# Altium schematic sheet SampleANDHold.SchDoc
size A4
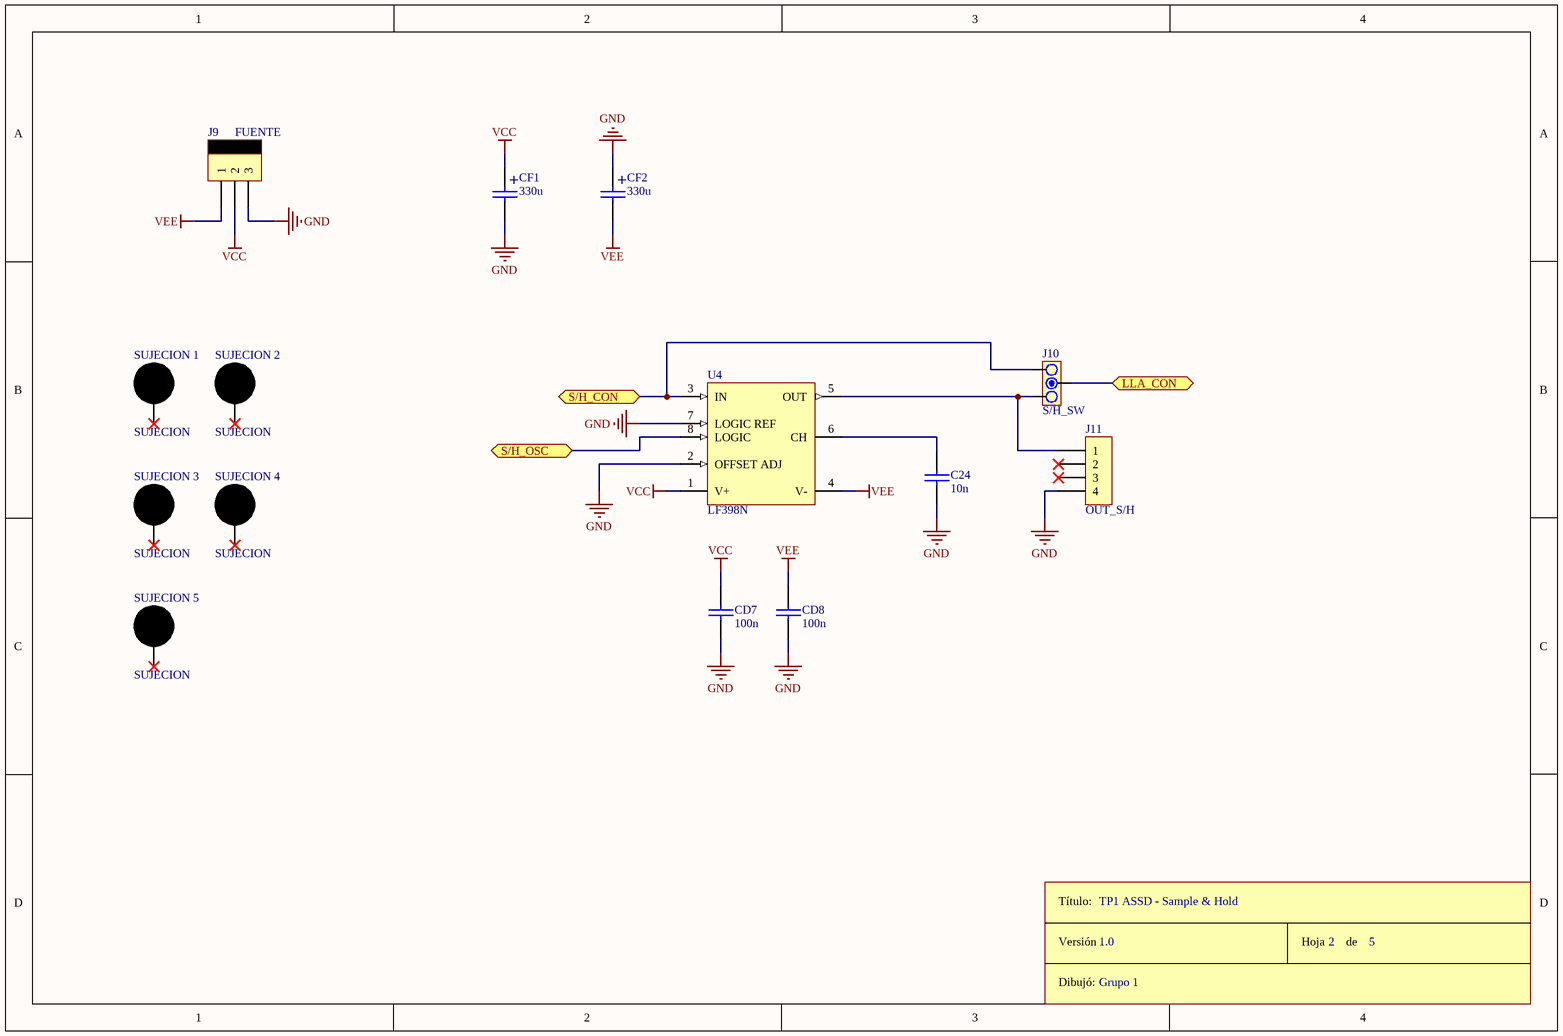
[diagram p0: SampleANDHold.SchDoc]

## Parts
C24  10n  [CAP100]
CD7  100n  [CAP100]
CD8  100n  [CAP100]
CF1  330u  [CAP200RP]
CF2  330u  [CAP200RP]
J9  FUENTE  [MOLEX3]
J10  S/H_SW  [JUMPER3]
J11  OUT_S/H  [SIP4]
ROT2  Rótulo  (value not drawn)
SUJECION_1  SUJECION  [SUJECION (5.00MM - 3.50MM)]
SUJECION_2  SUJECION  [SUJECION (5.00MM - 3.50MM)]
SUJECION_3  SUJECION  [SUJECION (5.00MM - 3.50MM)]
SUJECION_4  SUJECION  [SUJECION (5.00MM - 3.50MM)]
SUJECION_5  SUJECION  [SUJECION (5.00MM - 3.50MM)]
U4  LF398N  [N08E]

## Ports
LLA_CON, S/H_CON, S/H_OSC

## Nets
GND: C24.2 CD7.2 CD8.2 CF1.2 CF2.1 J9.3 J11.4 U4.2(OFFSET_ADJ) U4.7(LOGIC_REF)
VCC: CD7.1 CF1.1 J9.2 U4.1(V+)
VEE: CD8.1 CF2.2 J9.1 U4.4(V-)
LLA_CON: J10.2 ; port LLA_CON
S/H_CON: J10.3 U4.3(IN) ; port S/H_CON
S/H_OSC: U4.8(LOGIC) ; port S/H_OSC
NetC24_1: C24.1 U4.6(CH)
NetJ10_1: J10.1 J11.1 U4.5(OUT)

Not connected (* = marked no-connect by the designer): J11 2* 3*; SUJECION_1 1*; SUJECION_2 1*; SUJECION_3 1*; SUJECION_4 1*; SUJECION_5 1*

## Notes on the sheet
- TP1 ASSD - Sample & Hold
- 1.0
- Grupo 1
- 2
- 5
- (in symbol CAPPOL) +
- (in symbol Rótulo) Título:; Versión; Hoja       de; Dibujó:

## Library data of the parts
C24 CD7 CD8 = CAP
CF1 CF2 = CAPPOL
J9 = MOLEX3
J10 = JUMPER3
J11 = CON4
U4 = LF398N: Monolithic Sample-and-Hold Circuits; Manufacturer: National Semiconductor; CompType: Analog IC; PackageTopMarking: NSUZXYTT*LF*398N; PowerWise: N; Published: 4-Dec-2008; DatasheetVersion: Jul-2000; PackageVersion: revG, May-2006; PackageReference: N08E; Publisher: Altium Limited; PackageDescription: MDIP, .365 x .250 x .130in, 8 Lead, .100in Pitch; PartNumber: LF398N; PinCount: 8; DigiKeyPartNumber: LF398N-ND; Code_JEDEC: MS-001-BA; ComponentLink1Description: LF398 Datasheet; ComponentLink1URL: http://www.national.com/ds.cgi/LF/LF398.pdf; ComponentLink2Description: LF398 Web Page; ComponentLink2URL: http://www.national.com/pf/LF/LF398.html; ComponentLink3Description: N08E package page; ComponentLink3URL: http://www.national.com/packaging/folders/n08e.html